# EasyEDA Pro project ProDoc_双路DRV8701驱动_2025-08-21.epro

# Schematic Schematic1
Board Name: Board1; Create Date: 2025-03-01; Page Name: P1; Project Name: DRV8701单独驱动; Schematic Name: Schematic1; Update Date: 2025-03-07; Company: 嘉立创EDA; Page Size: A4; Version: V1.0
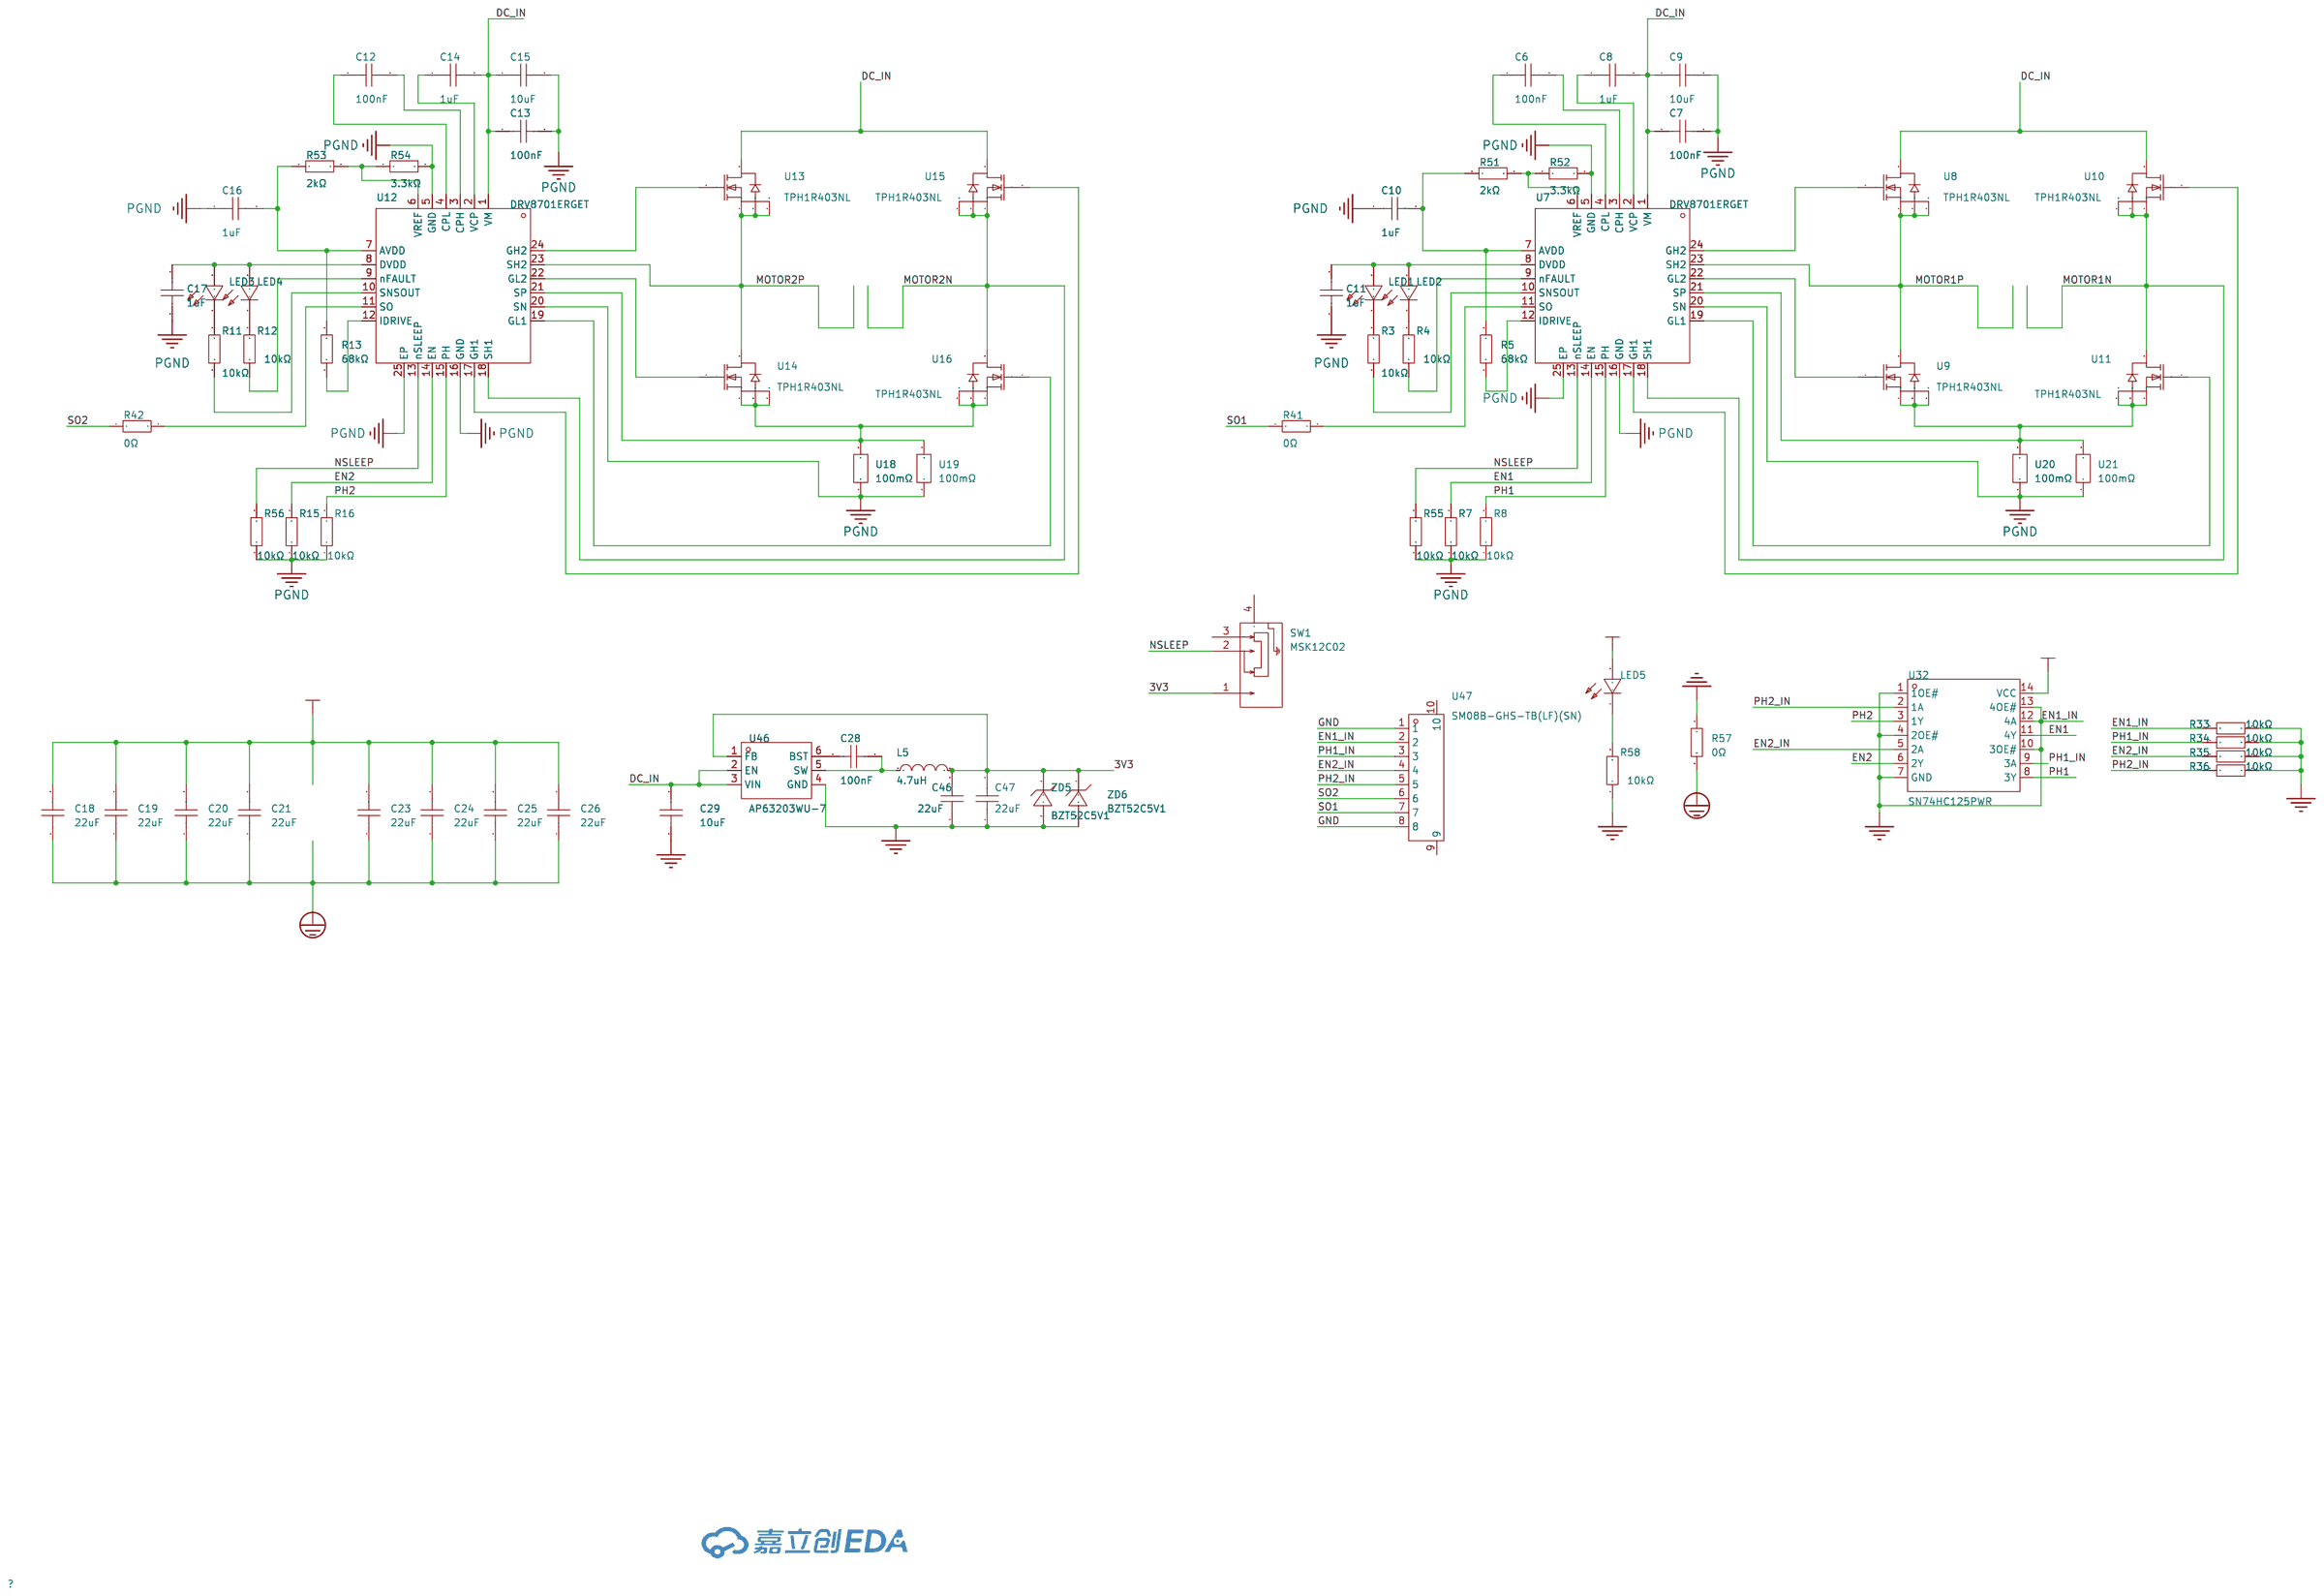
[diagram p0: schematic sheet]

## Parts
C6  100nF  [C0603]
C7  100nF  [C0603]
C8  1uF  [C0603]
C9  10uF  [C0603]
C10  1uF  [C0603]
C11  1uF  [C0603]
C12  100nF  [C0603]
C13  100nF  [C0603]
C14  1uF  [C0603]
C15  10uF  [C0603]
C16  1uF  [C0603]
C17  1uF  [C0603]
C18  22uF  [C1206]
C19  22uF  [C1206]
C20  22uF  [C1206]
C21  22uF  [C1206]
C23  22uF  [C1206]
C24  22uF  [C1206]
C25  22uF  [C1206]
C26  22uF  [C1206]
C28  100nF  [C0603]
C29  10uF  [C0603]
C46  22uF  [C0805]
C47  22uF  [C0805]
L5  4.7uH  [IND-SMD_L4.4-W4.2]
LED1  NCD0603R1  [LED0603-RD_RED]
LED2  NCD0603R1  [LED0603-RD_RED]
LED3  NCD0603R1  [LED0603-RD_RED]
LED4  NCD0603R1  [LED0603-RD_RED]
LED5  NCD0603R1  [LED0603-RD_RED]
R3  10kΩ  [R0603]
R4  10kΩ  [R0603]
R5  68kΩ  [R0603]
R7  10kΩ  [R0603]
R8  10kΩ  [R0603]
R11  10kΩ  [R0603]
R12  10kΩ  [R0603]
R13  68kΩ  [R0603]
R15  10kΩ  [R0603]
R16  10kΩ  [R0603]
R33  10kΩ  [R0603]
R34  10kΩ  [R0603]
R35  10kΩ  [R0603]
R36  10kΩ  [R0603]
R41  0Ω  [R0603]
R42  0Ω  [R0603]
R51  2kΩ  [R0603]
R52  3.3kΩ  [R0603]
R53  2kΩ  [R0603]
R54  3.3kΩ  [R0603]
R55  10kΩ  [R0603]
R56  10kΩ  [R0603]
R57  0Ω  [R0603]
R58  10kΩ  [R0603]
SW1  MSK12C02  [SW-TH_MSK12C02]
U7  DRV8701ERGET  [VQFN-24_L4.0-W4.0-P0.50-BL-EP2.5]
U8  TPH1R403NL  [TDSON-8_L5.9-W5.2-P1.27-BL]
U9  TPH1R403NL  [TDSON-8_L5.9-W5.2-P1.27-BL]
U10  TPH1R403NL  [TDSON-8_L5.9-W5.2-P1.27-BL]
U11  TPH1R403NL  [TDSON-8_L5.9-W5.2-P1.27-BL]
U12  DRV8701ERGET  [VQFN-24_L4.0-W4.0-P0.50-BL-EP2.5]
U13  TPH1R403NL  [TDSON-8_L5.9-W5.2-P1.27-BL]
U14  TPH1R403NL  [TDSON-8_L5.9-W5.2-P1.27-BL]
U15  TPH1R403NL  [TDSON-8_L5.9-W5.2-P1.27-BL]
U16  TPH1R403NL  [TDSON-8_L5.9-W5.2-P1.27-BL]
U18  100mΩ  [R1206]
U19  100mΩ  [R1206]
U20  100mΩ  [R1206]
U21  100mΩ  [R1206]
U32  SN74HC125PWR  [TSSOP-14_L5.0-W4.4-P0.65-LS6.5-BL]
U46  AP63203WU-7  [TSOT-26_L2.9-W1.6-P0.95-LS2.8-BL]
U47  SM08B-GHS-TB(LF)(SN)  [CONN-SMD_SM08B-GHS-TB-LF-SN]
ZD5  BZT52C5V1  [SOD-123_L2.8-W1.8-LS3.7-RD]
ZD6  BZT52C5V1  [SOD-123_L2.8-W1.8-LS3.7-RD]

## Library data of the parts
C6 C7 C12 C13 = CGA0603X7R104K500JT: 容值:100nF;精度:±10%;额定电压:50V;材质(温度系数):X7R;; LCSC Part Name: 100nF ±10% 50V; Supplier Part: C6119867; Manufacturer: HRE(芯声); Supplier Footprint: 0603; JLCPCB Part Class: 扩展库; Supplier: LCSC; Tolerance: ±10%; Voltage Rated: 50V; Temperature Coefficient: X7R
C8 C10 C11 C14 C16 C17 = CL10A105KB8NNNC: 容值:1uF;精度:±10%;额定电压:50V;材质(温度系数):X5R;; LCSC Part Name: 1uF ±10% 50V; Supplier Part: C15849; Manufacturer: SAMSUNG(三星); Supplier Footprint: 0603; JLCPCB Part Class: 基础库; Datasheet: https://atta.szlcsc.com/upload/public/pdf/source/20160218/1457707763339.pdf; Supplier: LCSC; Tolerance: ±10%; Voltage Rated: 50V; Temperature Coefficient: X5R
C9 C15 = GRM188R6YA106MA73D: 容值:10uF;精度:±20%;额定电压:35V;材质(温度系数):X5R;; LCSC Part Name: 10uF ±20% 35V; Supplier Part: C194427; Manufacturer: muRata(村田); Supplier Footprint: 0603; JLCPCB Part Class: 扩展库; Datasheet: https://atta.szlcsc.com/upload/public/pdf/source/20210128/C194427_FCA3640823207DDB58700A82F1A19B5F.pdf; Supplier: LCSC; Tolerance: ±20%; Voltage Rated: 35V; Temperature Coefficient: X5R
C18-C21 C23-C26 = CGA1206X5R226M350NT: 容值:22uF;精度:±20%;额定电压:35V;材质(温度系数):X5R;; LCSC Part Name: 22uF ±20% 35V; Supplier Part: C6119969; Manufacturer: HRE(芯声); Supplier Footprint: 1206; JLCPCB Part Class: 扩展库; Supplier: LCSC; Tolerance: ±20%; Voltage Rated: 35V; Temperature Coefficient: X5R
C28 C29 = CAP_0603: Supplier Footprint: 0603
C46 C47 = CAP_0805: Supplier Footprint: 0805
L5 = MWSA0402S-4R7MT: 电感值:4.7uH;精度:±20%;额定电流:2.8A;饱和电流(Isat):3A;类型:-;; LCSC Part Name: 4.7uH ±20% 3A; Supplier Part: C408337; Manufacturer: Sunlord(顺络); Supplier Footprint: SMD,4.4x4.2mm; JLCPCB Part Class: 扩展库; Datasheet: https://atta.szlcsc.com/upload/public/pdf/source/20231024/D9DB0CBBB5804BFBC9233D4A02F4216A.pdf; Supplier: LCSC; Tolerance: ±20%; Rated Current: 2.8A; Saturation Current (Isat): 3A; DC Resistance (DCR): 105mΩ
LED1-LED5 = NCD0603R1_C84263: 灯头类型:-;发光颜色:红色;正向电压(VF):1.6V~2.6V;功率:65mW;正向电流:20mA;主波长:615nm~630nm;二极管配置:独立二极管;透镜颜色:无色透明透镜;色温:-;发光强度:80mcd~220mcd;发光角度:130°;载带方式:-;工作温度:-30℃~+85℃;; Supplier Part: C84263; Manufacturer: 国星光电; Supplier Footprint: 0603; JLCPCB Part Class: 扩展库; Datasheet: https://atta.szlcsc.com/upload/public/pdf/source/20200820/C84263_DABC6A75E58F576973B407FDBA283D60.pdf; Supplier: LCSC; Emitted Color: 红色; Forward Voltage (VF): 1.6V~2.6V; Power Dissipation: 65mW; Forward Current: 20mA; Dominant Wavelength: 615nm~630nm; Diode Configuration: 独立二极管; Lens Color: 无色透明透镜; Luminous Intensity: 80mcd~220mcd; Viewing Angle: 130°; Operating Temperature: -30℃~+85℃
R3 R4 R7 R8 R11 R12 R15 R16 R33-R36 R55 R56 R58 = 0603WAF1002T5E: 电阻类型:厚膜电阻;阻值:10kΩ;精度:±1%;功率:100mW;最大工作电压:75V;温度系数:±100ppm/℃;; LCSC Part Name: 厚膜电阻 10kΩ ±1% 100mW; Supplier Part: C25804; Manufacturer: UNI-ROYAL(厚声); Supplier Footprint: 0603; JLCPCB Part Class: 基础库; Datasheet: https://atta.szlcsc.com/upload/public/pdf/source/20200306/C422600_1E6D84923E4A46A82E41ADD87F860B5C.pdf; Supplier: LCSC; Type: 厚膜电阻; Tolerance: ±1%; Power(Watts): 100mW; Overload Voltage (Max): 75V; Temperature Coefficient: ±100ppm/℃; Operating Temperature Range: -55℃~+155℃
R5 R13 = 0603WAF6802T5E: 电阻类型:厚膜电阻;阻值:68kΩ;精度:±1%;功率:100mW;最大工作电压:75V;温度系数:±100ppm/℃;; LCSC Part Name: 68kΩ ±1% 100mW 厚膜电阻; Supplier Part: C23231; Manufacturer: UNI-ROYAL(厚声); Supplier Footprint: 0603; JLCPCB Part Class: 基础库; Datasheet: https://atta.szlcsc.com/upload/public/pdf/source/20200306/C422600_1E6D84923E4A46A82E41ADD87F860B5C.pdf; Supplier: LCSC; Type: 厚膜电阻; Tolerance: ±1%; Power(Watts): 100mW; Overload Voltage (Max): 75V; Temperature Coefficient: ±100ppm/℃; Operating Temperature Range: -55℃~+155℃
R41 R42 R57 = 0603WAF0000T5E: 电阻类型:厚膜电阻;阻值:0Ω;精度:±1%;功率:100mW;最大工作电压:75V;; LCSC Part Name: 0Ω ±1% 100mW 厚膜电阻; Supplier Part: C21189; Manufacturer: UNI-ROYAL(厚声); Supplier Footprint: 0603; JLCPCB Part Class: 基础库; Datasheet: https://atta.szlcsc.com/upload/public/pdf/source/20200306/C422600_1E6D84923E4A46A82E41ADD87F860B5C.pdf; Supplier: LCSC; Type: 厚膜电阻; Tolerance: ±1%; Power(Watts): 100mW; Overload Voltage (Max): 75V; Operating Temperature Range: -55℃~+155℃
R51 R53 = 0603WAF2001T5E: 电阻类型:厚膜电阻;阻值:2kΩ;精度:±1%;功率:100mW;最大工作电压:75V;温度系数:±100ppm/℃;; LCSC Part Name: 2kΩ ±1% 100mW 厚膜电阻; Supplier Part: C22975; Manufacturer: UNI-ROYAL(厚声); Supplier Footprint: 0603; JLCPCB Part Class: 基础库; Datasheet: https://atta.szlcsc.com/upload/public/pdf/source/20200306/C422600_1E6D84923E4A46A82E41ADD87F860B5C.pdf; Supplier: LCSC; Type: 厚膜电阻; Tolerance: ±1%; Power(Watts): 100mW; Overload Voltage (Max): 75V; Temperature Coefficient: ±100ppm/℃; Operating Temperature Range: -55℃~+155℃
R52 R54 = 0603WAF3301T5E: 电阻类型:厚膜电阻;阻值:3.3kΩ;精度:±1%;功率:100mW;最大工作电压:75V;温度系数:±100ppm/℃;; LCSC Part Name: 3.3kΩ ±1% 100mW 厚膜电阻; Supplier Part: C22978; Manufacturer: UNI-ROYAL(厚声); Supplier Footprint: 0603; JLCPCB Part Class: 基础库; Datasheet: https://atta.szlcsc.com/upload/public/pdf/source/20200306/C422600_1E6D84923E4A46A82E41ADD87F860B5C.pdf; Supplier: LCSC; Type: 厚膜电阻; Tolerance: ±1%; Power(Watts): 100mW; Overload Voltage (Max): 75V; Temperature Coefficient: ±100ppm/℃; Operating Temperature Range: -55℃~+155℃
SW1 = MSK12C02: 电路结构:单刀双掷;安装方式:卧贴;开关颜色:-;额定电流(DC):50mA;额定电压(DC):12V;额定电流(AC):-;额定电压(AC):-;机械寿命:1万次;; LCSC Part Name: 两档侧拨贴片 7脚 滑动开关; Supplier Part: C431540; Manufacturer: SHOU HAN(首韩); Supplier Footprint: SMD; JLCPCB Part Class: 扩展库; Datasheet: https://atta.szlcsc.com/upload/public/pdf/source/20190925/C431540_89155AEF0758B9AD1B2D805F83FB12E3.pdf; Supplier: LCSC; Circuit: 单刀双掷; Pin Style: SMD接片; Switch Length: 8mm; Switch Width: 2.8mm; Switch Height: 1.4mm; Mounting Style: 卧贴; Current Rating (DC): 50mA; Voltage Rating (DC): 12V; Mechanical Life: 1万次; Operating Temperature: -20℃~+70℃
U7 U12 = DRV8701ERGET: DRV8701 47V H 桥智能栅极驱动器; LCSC Part Name: 有刷直流电机驱动芯片 5.5V; Supplier Part: C132049; Manufacturer: TI(德州仪器); Supplier Footprint: VQFN-24(4x4); JLCPCB Part Class: 扩展库; Datasheet: https://www.ti.com/cn/lit/gpn/drv8701; Supplier: LCSC
U8-U11 U13-U16 = TPH1R403NL_C19268167: Supplier Part: C19268167; Manufacturer: TECH PUBLIC(台舟); JLCPCB Part Class: 扩展库; Datasheet: https://atta.szlcsc.com/upload/public/pdf/source/20231201/E668D9B30DA1C5FDF2CA4EE637776407.pdf; Supplier: LCSC
U18-U21 = FRM121WFR100TM: 电阻类型:采样电阻;阻值:100mΩ;精度:±1%;额定压降:-;功率:1W;温度系数:±50ppm/℃;安装方式:-;; LCSC Part Name: 100mΩ ±1% 1W; Supplier Part: C7467250; Manufacturer: FOJAN(富捷); Supplier Footprint: 1206; JLCPCB Part Class: 扩展库; Supplier: LCSC; Type: 采样电阻; Tolerance: ±1%; Power(Watts): 1W; Temperature Coefficient: ±50ppm/℃
U32 = SN74HC125PWR: 输入类型:-;电源电压:2V~6V;元件数:4;每个元件位数:1;灌电流(IOL):7.8mA;拉电流(IOH):7.8mA;; Supplier Part: C132994; Manufacturer: TI(德州仪器); Supplier Footprint: TSSOP-14; JLCPCB Part Class: 扩展库; Datasheet: https://www.ti.com/cn/lit/gpn/sn74hc125; Supplier: LCSC; output type: 三态; Supply Voltage: 2V~6V; Number of Elements: 4; Number of Bits per Element: 1; Sink Current: 7.8mA; Source Current: 7.8mA; Logic Family: 74HC; Operating Temperature: -40℃~+85℃
U46 = AP63203WU-7: 功能类型:降压型;输出类型:固定;输入电压:3.8V~32V;输出电压:3.3V;输出电流(最大值):2A;; Supplier Part: C780769; Manufacturer: DIODES(美台); Supplier Footprint: TSOT-23-6; JLCPCB Part Class: 扩展库; Datasheet: https://atta.szlcsc.com/upload/public/pdf/source/20210622/C780769_099C67289BD3EC61AAFB52D8B07125B3.pdf; Supplier: LCSC; Function: 降压型; Output Type: 固定; Input Voltage: 3.8V~32V; Output Voltage: 3.3V; Output Current (Max): 2A; Switching Frequency: 1.1MHz; Operating Temperature: -40℃~+85℃@(TA); Synchronous Rectification: 是; Number of Outputs: 1; Topology: 降压式; Switch tube (built-in/external): 内置
U47 = SM08B-GHS-TB(LF)(SN): 插针结构:1x8P;间距:1.25mm;安装方式:卧贴;参考系列:GH;总PIN数:8P;排数:1;每排PIN数:8;行距:-;额定电流:1A;触头材质:磷青铜;触头镀层:锡;工作温度范围:-25℃~+85℃;; LCSC Part Name: 1x8P 间距:1.25mm 卧贴 系列:GH; Supplier Part: C265111; Manufacturer: JST; Supplier Footprint: SMD,P=1.25mm,卧贴; JLCPCB Part Class: 扩展库; Datasheet: https://atta.szlcsc.com/upload/public/pdf/source/20221128/D5F81EE9B4EA03745FB033843433A0AF.pdf; Supplier: LCSC; Pins Structure: 1x8P; Pitch: 1.25mm; Mounting Style: 卧贴; Reference Series: GH; Number of Pins: 8P; Number of Rows: 1; Number of PINs Per Row: 8; Current Rating (Max): 1A; Contact Material: 磷青铜; Contact Plating: 锡; Operating Temperature Range: -25℃~+85℃; Rated Voltage (Max): 50V; Plastic Material: PA9T; Flame Retardant Rating: UL94V-0; Supplementary Features: 辅助焊脚; Colour: 白色; Z-Height of the Board: 4.25mm; X-Length of Bottom Edge on Board (Spacing Line): 13.25mm; Y-Width of Bottom Edge on Board: 4.13mm
ZD5 ZD6 = BZT52C5V1_C2117: 二极管配置:独立式;稳压值(标称值):5.1V;稳压值(范围):4.8V~5.4V;功率:350mW;精度:-;; LCSC Part Name: BZT52C5V1 W8; Supplier Part: C2117; Manufacturer: CJ(江苏长电/长晶); Supplier Footprint: SOD-123; JLCPCB Part Class: 扩展库; Datasheet: https://atta.szlcsc.com/upload/public/pdf/source/20140508/1457707057629.pdf; Supplier: LCSC; Diode Configuration: 独立式; Zener Voltage (Nom): 5.1V; Reverse Leakage Current (Ir): 2uA@2V; Zener Voltage (Range): 4.8V~5.4V; Power Dissipation: 350mW; Zener Impedance (Zzt): 60Ω

## Nets
3V3: C46.2 C47.2 L5.2 LED5.2(A) SW1.1 U32.14(VCC) U46.1(FB) ZD5.1(K) ZD6.1(K)
GND: C29.1 C46.1 C47.1 R33.2 R34.2 R35.2 R36.2 R57.1 R58.1 U32.1(1OE#) U32.4(2OE#) U32.7(GND) U32.10(3OE#) U32.13(4OE#) U46.4(GND) U47.1 U47.8 ZD5.2(A) ZD6.2(A)
PGND: C7.2 C9.2 C10.1 C11.1 C13.2 C15.2 C16.1 C17.1 C18.1 C19.1 C20.1 C21.1 C23.1 C24.1 C25.1 C26.1 R7.1 R8.1 R15.1 R16.1 R52.2 R54.2 R55.1 R56.1 R57.2 U7.5(GND) U7.16(GND) U7.20(SN) U7.25(EP) U12.5(GND) U12.16(GND) U12.20(SN) U12.25(EP) U18.1 U19.1 U20.1 U21.1
DC_IN: C7.1 C8.2 C9.1 C13.1 C14.2 C15.1 C18.2 C19.2 C20.2 C21.2 C23.2 C24.2 C25.2 C26.2 C29.2 U7.1(VM) U8.5(D) U10.5(D) U12.1(VM) U13.5(D) U15.5(D) U46.2(EN) U46.3(VIN)
EN1: R7.2 U7.14(EN) U32.11(4Y)
EN1_IN: R33.1 U32.12(4A) U47.2
EN2: R15.2 U12.14(EN) U32.6(2Y)
EN2_IN: R35.1 U32.5(2A) U47.4
MOTOR1N: U7.18(SH1) U10.1(S) U10.2(S) U10.3(S) U11.5(D)
MOTOR1P: U7.23(SH2) U8.1(S) U8.2(S) U8.3(S) U9.5(D)
MOTOR2N: U12.18(SH1) U15.1(S) U15.2(S) U15.3(S) U16.5(D)
MOTOR2P: U12.23(SH2) U13.1(S) U13.2(S) U13.3(S) U14.5(D)
NSLEEP: R55.2 R56.2 SW1.2 U7.13(nSLEEP) U12.13(nSLEEP)
PH1: R8.2 U7.15(PH) U32.8(3Y)
PH1_IN: R34.1 U32.9(3A) U47.3
PH2: R16.2 U12.15(PH) U32.3(1Y)
PH2_IN: R36.1 U32.2(1A) U47.5
SO1: R41.1 U47.7
SO2: R42.1 U47.6
$1N2211: C11.2 LED1.2(A) LED2.2(A) U7.8(DVDD)
$1N2213: R41.2 U7.11(SO)
$1N2223: C10.2 R5.2 R51.1 U7.7(AVDD)
$1N2224: R5.1 U7.12(IDRIVE)
$1N2225: R4.1 U7.9(nFAULT)
$1N2226: R3.1 U7.10(SNSOUT)
$1N2227: LED2.1(K) R4.2
$1N2228: LED1.1(K) R3.2
$1N2229: R51.2 R52.1 U7.6(VREF)
$1N2235: C8.1 U7.2(VCP)
$1N2236: C6.1 U7.4(CPL)
$1N2237: C6.2 U7.3(CPH)
$1N2244: U7.17(GH1) U10.4(G)
$1N2245: U7.19(GL1) U11.4(G)
$1N2246: U7.21(SP) U9.1(S) U9.2(S) U9.3(S) U11.1(S) U11.2(S) U11.3(S) U20.2 U21.2
$1N2248: U7.22(GL2) U9.4(G)
$1N2249: U7.24(GH2) U8.4(G)
$1N2250: U12.24(GH2) U13.4(G)
$1N2251: U12.22(GL2) U14.4(G)
$1N2253: U12.21(SP) U14.1(S) U14.2(S) U14.3(S) U16.1(S) U16.2(S) U16.3(S) U18.2 U19.2
$1N2254: U12.19(GL1) U16.4(G)
$1N2255: U12.17(GH1) U15.4(G)
$1N2262: C12.2 U12.3(CPH)
$1N2263: C12.1 U12.4(CPL)
$1N2264: C14.1 U12.2(VCP)
$1N2270: R53.2 R54.1 U12.6(VREF)
$1N2271: C17.2 LED3.2(A) LED4.2(A) U12.8(DVDD)
$1N2272: LED3.1(K) R11.2
$1N2273: LED4.1(K) R12.2
$1N2274: R11.1 U12.10(SNSOUT)
$1N2275: R12.1 U12.9(nFAULT)
$1N2277: R42.2 U12.11(SO)
$1N2278: R13.1 U12.12(IDRIVE)
$1N2279: C16.2 R13.2 R53.1 U12.7(AVDD)
$1N16004: C28.2 L5.1 U46.5(SW)
$1N16007: C28.1 U46.6(BST)
$1N18591: LED5.1(K) R58.2

Not connected (* = marked no-connect by the designer): SW1 3 4; U47 9 10

# Board PCB1
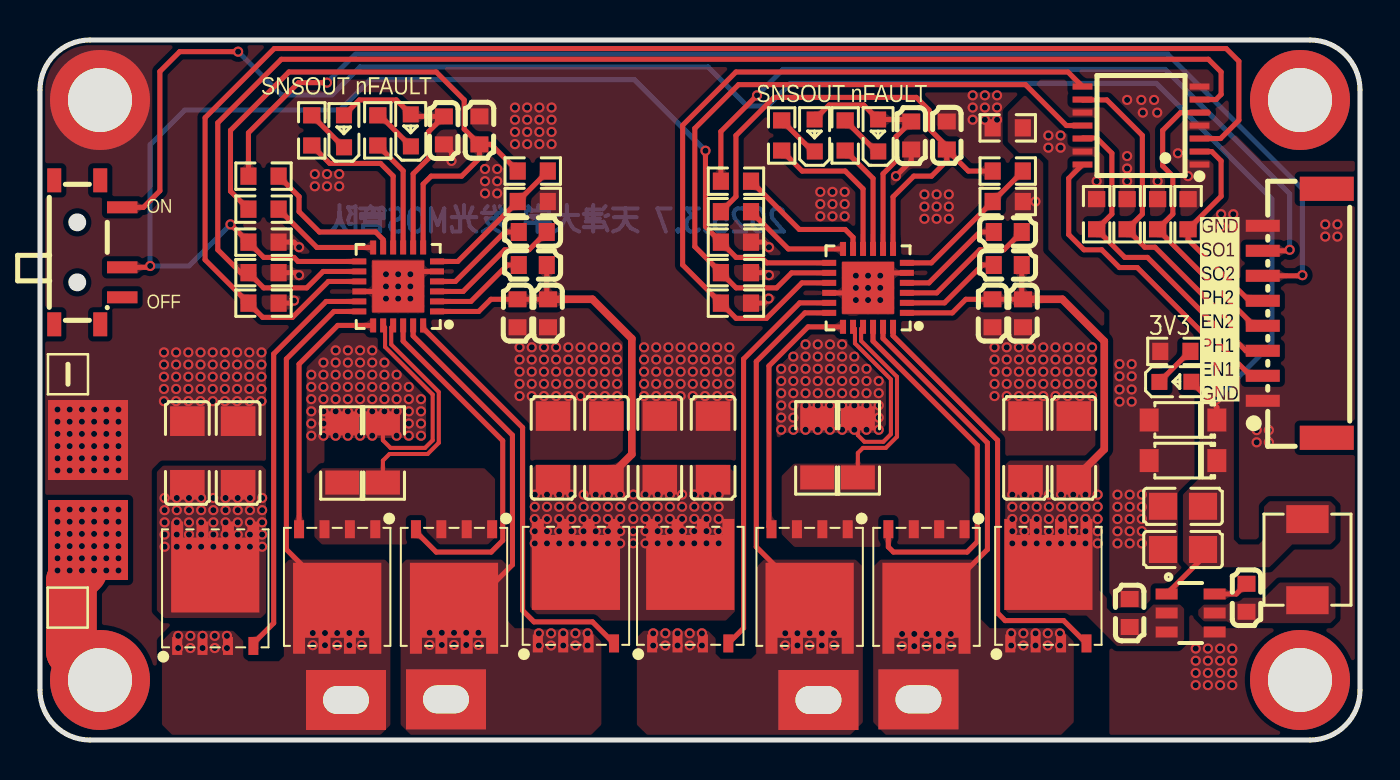
[diagram p1: board, top side]
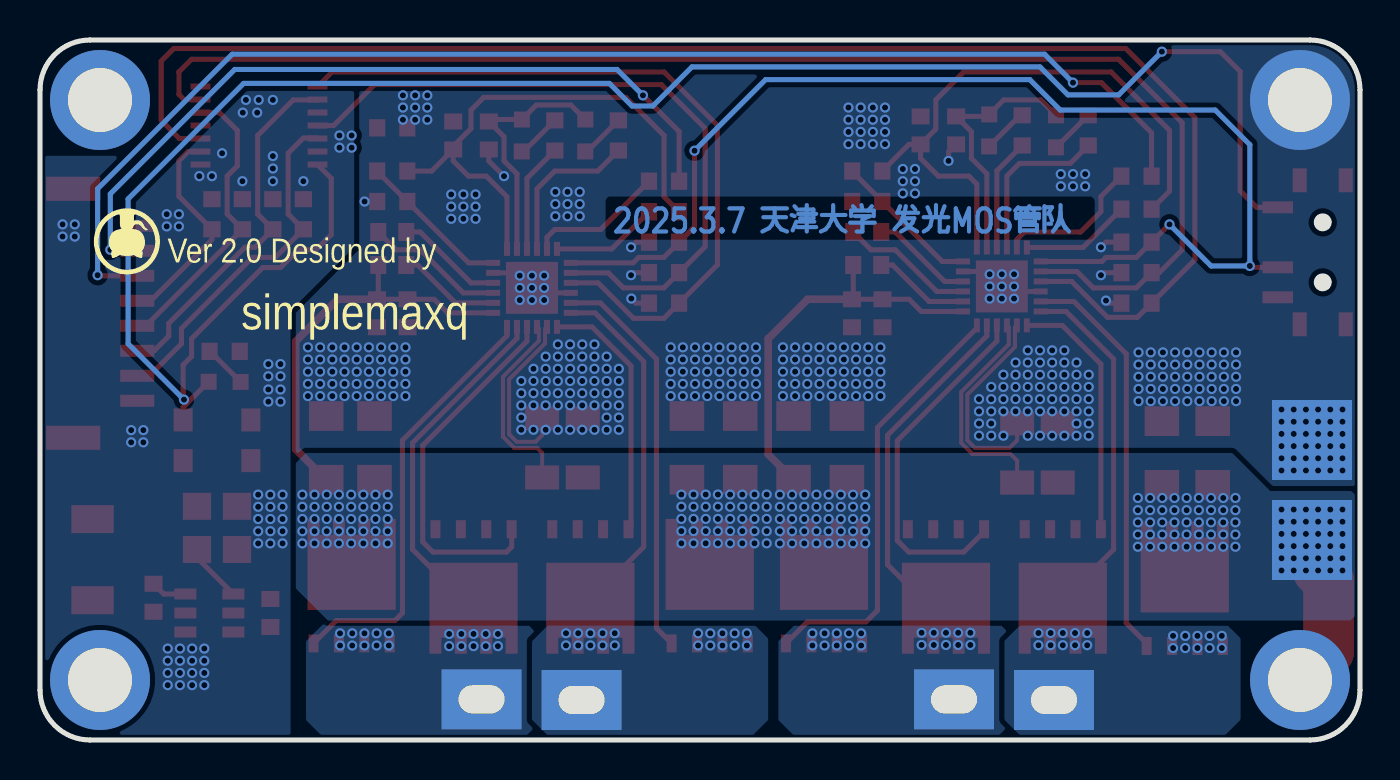
[diagram p2: board, bottom side, seen from below]

Outline 66 x 35 mm; copper layers: Top Layer, Bottom Layer. Coordinates in mm from the lower left corner of the outline.
Outline path: 0,32.5 0,2.5 arc(0.73,0.73) 2.5,0 63.5,0 arc(65.27,0.73) 66,2.5 66,32.5 arc(65.27,34.27) 63.5,35 2.5,35 arc(0.73,34.27) 0,32.5
Stack: Top Layer 0.035mm / Dielectric1 1.51mm FR4 er 4.5 / Bottom Layer 0.035mm

## Design rules (mm)
template: 自定义配置
spacing copperThickness1oz (default): track to track 0.102, other pairs 0.152 to 0.3
spacing copperThickness2oz: track to track 0.203, other pairs 0.152 to 0.3
track width copperThickness1oz (default): min 0.127, default 0.254, max 2.54
track width copperThickness2oz: min 0.203, default 0.254, max 2.54
differential pair differentialPair (default): width min 0.127, default 0.254, max 2.54; gap min 0.152, default 0.152
via viaSize (default): diameter min 0.5, default 0.61, max 10; hole min 0.3, default 0.305, max 6.3

## Placement (name value [footprint] x y rotation side)
C6  100nF  [C0603]  48.39 25.4 0 top
C7  100nF  [C0603]  49.15 21.34 270 top
C8  1uF  [C0603]  48.39 23.75 0 top
C9  10uF  [C0603]  47.62 21.34 270 top
C10  1uF  [C0603]  45.34 30.23 270 top
C11  1uF  [C0603]  43.56 30.23 90 top
C12  100nF  [C0603]  24.64 25.4 0 top
C13  100nF  [C0603]  23.88 21.34 270 top
C14  1uF  [C0603]  24.64 23.75 0 top
C15  10uF  [C0603]  25.4 21.34 270 top
C16  1uF  [C0603]  21.97 30.48 270 top
C17  1uF  [C0603]  20.19 30.48 90 top
C18  22uF  [C1206]  9.91 14.35 270 top
C19  22uF  [C1206]  7.37 14.35 270 top
C20  22uF  [C1206]  25.65 14.61 270 top
C21  22uF  [C1206]  28.32 14.61 270 top
C23  22uF  [C1206]  51.69 14.61 270 top
C24  22uF  [C1206]  49.28 14.61 270 top
C25  22uF  [C1206]  33.66 14.61 270 top
C26  22uF  [C1206]  30.99 14.61 270 top
C28  100nF  [C0603]  60.32 7.11 270 top
C29  10uF  [C0603]  54.48 6.35 270 top
C46  22uF  [C0805]  57.15 9.53 0 top
C47  22uF  [C0805]  57.15 11.68 0 top
L5  4.7uH  [IND-SMD_L4.4-W4.2]  63.37 9.02 270 top
LED1  NCD0603R1  [LED0603-RD_RED]  38.74 30.23 90 top
LED2  NCD0603R1  [LED0603-RD_RED]  41.91 30.23 90 top
LED3  NCD0603R1  [LED0603-RD_RED]  15.2 30.43 90 top
LED4  NCD0603R1  [LED0603-RD_RED]  18.54 30.48 90 top
LED5  NCD0603R1  [LED0603-RD_RED]  56.77 17.91 0 top
NOREF  -  [Pad_e3047]  2.4 10 0 top
NOREF#2  -  [Pad_e85]  63 32 0 top
NOREF#3  -  [Pad_e88]  3 3 0 top
NOREF#4  -  [Pad_e72]  63 3 0 top
NOREF#5  -  [Pad_e3065]  15.3 2 0 top
NOREF#6  -  [Pad_e89]  3 32 0 top
NOREF#7  -  [Pad_e3069]  43.92 2.03 0 top
NOREF#8  -  [Pad_e239]  2.4 15 0 top
NOREF#9  -  [Pad_e3067]  20.3 2.03 0 top
NOREF#10  -  [Pad_e3046]  2.4 15 0 top
NOREF#11  -  [Pad_e3068]  38.92 2 0 top
NOREF#12  -  [Pad_e237]  2.4 10 0 top
R3  10kΩ  [R0603]  37.08 30.23 90 top
R4  10kΩ  [R0603]  40.26 30.23 90 top
R5  68kΩ  [R0603]  34.8 26.42 180 top
R7  10kΩ  [R0603]  34.8 23.37 180 top
R8  10kΩ  [R0603]  34.8 21.84 180 top
R11  10kΩ  [R0603]  13.59 30.48 90 top
R12  10kΩ  [R0603]  16.89 30.48 90 top
R13  68kΩ  [R0603]  11.18 26.54 180 top
R15  10kΩ  [R0603]  11.18 23.37 180 top
R16  10kΩ  [R0603]  11.18 21.84 180 top
R33  10kΩ  [R0603]  52.83 26.29 90 top
R34  10kΩ  [R0603]  54.36 26.29 90 top
R35  10kΩ  [R0603]  55.88 26.29 90 top
R36  10kΩ  [R0603]  57.4 26.29 90 top
R41  0Ω  [R0603]  34.8 27.94 0 top
R42  0Ω  [R0603]  11.18 28.19 0 top
R51  2kΩ  [R0603]  48.39 28.45 0 top
R52  3.3kΩ  [R0603]  48.39 26.92 0 top
R53  2kΩ  [R0603]  24.64 28.45 0 top
R54  3.3kΩ  [R0603]  24.64 26.92 0 top
R55  10kΩ  [R0603]  34.8 24.89 180 top
R56  10kΩ  [R0603]  11.18 24.89 180 top
R57  0Ω  [R0603]  48.39 30.61 180 top
R58  10kΩ  [R0603]  56.77 19.43 0 top
SW1  MSK12C02  [SW-TH_MSK12C02]  2.41 24.38 270 top
U7  DRV8701ERGET  [VQFN-24_L4.0-W4.0-P0.50-BL-EP2.5]  41.4 22.61 90 top
U8  TPH1R403NL  [TDSON-8_L5.9-W5.2-P1.27-BL]  50.42 6.6 0 top
U9  TPH1R403NL  [TDSON-8_L5.9-W5.2-P1.27-BL]  44.32 8.76 180 top
U10  TPH1R403NL  [TDSON-8_L5.9-W5.2-P1.27-BL]  32.51 6.6 0 top
U11  TPH1R403NL  [TDSON-8_L5.9-W5.2-P1.27-BL]  38.48 8.76 180 top
U12  DRV8701ERGET  [VQFN-24_L4.0-W4.0-P0.50-BL-EP2.5]  17.91 22.68 90 top
U13  TPH1R403NL  [TDSON-8_L5.9-W5.2-P1.27-BL]  26.8 6.6 0 top
U14  TPH1R403NL  [TDSON-8_L5.9-W5.2-P1.27-BL]  20.7 8.76 180 top
U15  TPH1R403NL  [TDSON-8_L5.9-W5.2-P1.27-BL]  8.76 6.48 0 top
U16  TPH1R403NL  [TDSON-8_L5.9-W5.2-P1.27-BL]  14.86 8.76 180 top
U18  100mΩ  [R1206]  17.15 14.35 270 top
U19  100mΩ  [R1206]  15.11 14.35 270 top
U20  100mΩ  [R1206]  38.86 14.61 270 top
U21  100mΩ  [R1206]  40.89 14.61 270 top
U32  SN74HC125PWR  [TSSOP-14_L5.0-W4.4-P0.65-LS6.5-BL]  55.05 30.72 90 top
U46  AP63203WU-7  [TSOT-26_L2.9-W1.6-P0.95-LS2.8-BL]  57.53 6.35 270 top
U47  SM08B-GHS-TB(LF)(SN)  [CONN-SMD_SM08B-GHS-TB-LF-SN]  62.74 21.34 90 top
ZD5  BZT52C5V1  [SOD-123_L2.8-W1.8-LS3.7-RD]  57.15 16 180 top
ZD6  BZT52C5V1  [SOD-123_L2.8-W1.8-LS3.7-RD]  57.15 13.97 180 top

## Footprints (pads in the part's own frame, mm; a bottom-side part is the same pattern mirrored in y, then rotated)
C0603
  rect 0.8x0.9 smd: 1(-0.7,0) 2(0.7,0)
C0805
  rect 1.41x1.35 smd: 1(-1,0) 2(1,0)
C1206
  rect 1.485x1.728 smd: 1(-1.593,0) 2(1.593,0)
CONN-SMD_SM08B-GHS-TB-LF-SN
  rect 0.6x1.7 smd: 1(-4.375,1.6) 2(-3.125,1.6) 3(-1.875,1.6) 4(-0.625,1.6) 5(0.625,1.6) 6(1.875,1.6) 7(3.125,1.6) 8(4.375,1.6)
  rect 1.21x2.7 smd: 9(-6.225,-1.6) 10(6.225,-1.6)
IND-SMD_L4.4-W4.2
  rect 1.4x2.12 smd: 1(2.028,0) 2(-2.028,0)
LED0603-RD_RED
  rect 0.8x0.8 smd: 1(-0.799,-0.004) 2(0.799,0.004)
Pad_e72
  round 5 hole 3.2: 1(0,0)
Pad_e85
  round 5 hole 3.2: 1(0,0)
Pad_e88
  round 5 hole 3.2: 1(0,0)
Pad_e89
  round 5 hole 3.2: 1(0,0)
Pad_e237
  rect 4x4 smd: 1(0,0)
Pad_e239
  rect 4x4 smd: 1(0,0)
Pad_e3046
  rect 4x4 smd far side: 1(0,0)
Pad_e3047
  rect 4x4 smd far side: 1(0,0)
Pad_e3065
  rect 4x3 hole 2.3x1.4: 1(0,0)
Pad_e3067
  rect 4x3 hole 2.3x1.4: 1(0,0)
Pad_e3068
  rect 4x3 hole 2.3x1.4: 1(0,0)
Pad_e3069
  rect 4x3 hole 2.3x1.4: 1(0,0)
R0603
  rect 0.806x0.864 smd: 1(-0.753,0) 2(0.753,0)
R1206
  rect 1.208x1.701 smd: 1(-1.479,0) 2(1.479,0)
SOD-123_L2.8-W1.8-LS3.7-RD
  rect 0.95x1.15 smd: 1(-1.692,0) 2(1.692,0)
SW-TH_MSK12C02
  rect 0.6x1.524 smd: 1(-2.25,1.7) 2(0.75,1.7) 3(2.25,1.7)
  rect 1.2x0.7 smd: 4(-3.6,0.6) 4(-3.6,-1.7) 4(3.6,0.6) 4(3.6,-1.7)
TDSON-8_L5.9-W5.2-P1.27-BL
  rect 0.5x0.9 smd: 1(-1.905,-1.775) 2(-0.635,-1.775) 3(0.635,-1.775) 4(1.905,-1.775)
  custom 4.41x4.55 smd: 5(0,1.775)
TSOT-26_L2.9-W1.6-P0.95-LS2.8-BL
  rect 0.55x1.1 smd: 1(-0.95,-1.2) 2(0,-1.2) 3(0.95,-1.2) 4(0.95,1.2) 5(0,1.2) 6(-0.95,1.2)
TSSOP-14_L5.0-W4.4-P0.65-LS6.5-BL
  rect 0.305x0.991 smd: 1(-1.95,-2.925) 2(-1.3,-2.925) 3(-0.65,-2.925) 4(0,-2.925) 5(0.65,-2.925) 6(1.3,-2.925) 7(1.95,-2.925) 8(1.95,2.925) 9(1.3,2.925) 10(0.65,2.925) 11(0,2.925) 12(-0.65,2.925) 13(-1.3,2.925) 14(-1.95,2.925)
VQFN-24_L4.0-W4.0-P0.50-BL-EP2.5
  rect 0.3x0.7 smd: 1(-1.25,-1.942) 2(-0.75,-1.942) 3(-0.25,-1.942) 4(0.25,-1.942) 5(0.75,-1.942) 6(1.25,-1.942) 13(1.25,1.942) 14(0.75,1.942) 15(0.25,1.942) 16(-0.25,1.942) 17(-0.75,1.942) 18(-1.25,1.942)
  rect 0.7x0.3 smd: 7(1.948,-1.25) 8(1.948,-0.75) 9(1.948,-0.25) 10(1.948,0.25) 11(1.948,0.75) 12(1.948,1.25) 19(-1.948,1.25) 20(-1.948,0.75) 21(-1.948,0.25) 22(-1.948,-0.25) 23(-1.948,-0.75) 24(-1.948,-1.25)
  rect 2.6x2.6 smd: 25(0.001,-0.001)

## Nets
As in the schematic, except:
PGND: C7.2 C9.2 C10.1 C11.1 C13.2 C15.2 C16.1 C17.1 C18.1 C19.1 C20.1 C21.1 C23.1 C24.1 C25.1 C26.1 NOREF#6.1 NOREF#8.1 NOREF#10.1 R7.1 R8.1 R15.1 R16.1 R52.2 R54.2 R55.1 R56.1 R57.2 U7.5 U7.16 U7.20 U7.25 U12.5 U12.16 U12.20 U12.25 U18.1 U19.1 U20.1 U21.1
DC_IN: C7.1 C8.2 C9.1 C13.1 C14.2 C15.1 C18.2 C19.2 C20.2 C21.2 C23.2 C24.2 C25.2 C26.2 C29.2 NOREF.1 NOREF#3.1 NOREF#12.1 U7.1 U8.5 U10.5 U12.1 U13.5 U15.5 U46.2 U46.3
MOTOR1N: NOREF#11.1 U7.18 U10.1 U10.2 U10.3 U11.5
MOTOR1P: NOREF#7.1 U7.23 U8.1 U8.2 U8.3 U9.5
MOTOR2N: NOREF#5.1 U12.18 U15.1 U15.2 U15.3 U16.5
MOTOR2P: NOREF#9.1 U12.23 U13.1 U13.2 U13.3 U14.5

Pads without a net: NOREF#2 1; NOREF#4 1; SW1 3 4; U47 9 10

## Via types
v1: diameter 0.508, hole 0.305, Top Layer to Bottom Layer, 768 vias

## Routing (per net, layer and track width the routed paths; a pad name or vN(x,y) marks a point on that pad's centre or on a via; arc(x,y) is an arc through that point)
3V3: length 102.1
  Top Layer w0.254: C46.2 58.15,9.12 U46.1 ; U32.14 51.44,28.08 51.44,25.27 52.2,24.51 53.09,24.51 53.97,23.62 54.86,23.62 58.42,20.07 58.42,19.18 58.84,18.75 58.84,17.02 ; ZD5.1 58.84,16.64 LED5.2 ; SW1.1 5.17,26.63 5.99,27.46 5.99,33.43 6.98,34.42 v1(9.91,34.42)
  Bottom Layer w0.254: v1(58.8,17.02) 61.59,19.81 61.59,27.05 55.82,32.83 37.53,32.83 36.4,31.7 35.36,31.7 33.4,33.66 16,33.66 14.6,32.26 12.06,32.26 v1(9.91,34.42)
GND:
  vias: v1(50.42,30.23) v1(50.42,29.62) v1(51.03,30.23) v1(51.03,29.62) v1(52.83,27.94) v1(53.87,12.27) v1(53.87,11.66) v1(53.87,11.05) v1(53.87,10.44) v1(53.87,9.83) v1(53.97,18.8) v1(53.97,18.19) v1(53.97,17.53) v1(53.97,16.92) v1(54.36,32) v1(54.36,29.2) v1(54.36,28.58) v1(54.36,27.94) v1(54.48,12.27) v1(54.48,11.66) v1(54.48,11.05) v1(54.48,10.44) v1(54.48,9.83) v1(54.58,18.8) v1(54.58,18.19) v1(54.58,17.53) v1(54.58,16.92) v1(55.06,32) v1(55.14,31.37) v1(55.09,12.27) v1(55.09,11.66) v1(55.09,11.05) v1(55.09,10.44) v1(55.09,9.83) v1(55.7,32) v1(55.86,31.37) v1(55.88,27.94) v1(56.9,29.34) v1(57.4,28.19) v1(57.78,4.57) v1(57.78,3.96) v1(57.78,3.35) v1(57.78,2.74) v1(58.04,28.19) v1(58.39,4.57) v1(58.39,3.96) v1(58.39,3.35) v1(58.39,2.74) v1(59,4.57) v1(59,3.96) v1(59,3.35) v1(59,2.74) v1(59.06,26.29) v1(59.06,25.68) v1(59.61,4.57) v1(59.61,3.96) v1(59.61,3.35) v1(59.61,2.74) v1(59.66,26.29) v1(59.66,25.68) v1(60.83,15.49) v1(60.83,14.88) v1(61.44,15.49) v1(61.44,14.88) v1(64.26,25.78) v1(64.26,25.17) v1(64.87,25.78) v1(64.87,25.17)
PGND: length 36.3
  Top Layer w0.203: U12.20 17.25,20.63 17.25,19.65 19.63,17.27 19.63,14.99 19.25,14.61 17.53,14.61 17.15,14.99 U18.1 ; U21.1 40.89,15.24 41.22,14.91 42.16,14.91 42.54,15.29 42.54,18.03 40.75,19.83 40.75,20.56 U7.20
  Top Layer w0.254: R52.2 v1(49.77,26.92) ; R56.1 12.7,24.89 v1(12.95,24.64) ; R16.1 12.57,21.84 v1(12.7,21.97) ; C11.1 43.56,28.96 v1(42.8,28.19) ; U7.16 41.15,22.36 v1(41.4,22.61) ; C17.1 20.57,29.4 v1(20.57,28.96) ; v1(12.95,23.24) 12.83,23.37 R15.1 ; v1(42.01,23.22) 42.15,23.36 U7.5 ; R7.1 36.32,23.37 v1(36.45,23.24) ; v1(36.43,22.07) 36.21,21.84 R8.1 ; U12.16 17.66,22.43 v1(17.91,22.68) 18.66,23.43 U12.5 ; v1(36.45,24.64) 36.19,24.89 R55.1
  vias: v1(0.88,16.52) v1(0.88,15.91) v1(0.88,15.31) v1(0.88,14.69) v1(0.88,14.09) v1(0.88,13.48) v1(1.49,16.52) v1(1.49,15.91) v1(1.49,15.31) v1(1.49,14.69) v1(1.49,14.09) v1(1.49,13.48) v1(2.09,16.52) v1(2.09,15.91) v1(2.09,15.31) v1(2.09,14.69) v1(2.09,14.09) v1(2.09,13.48) v1(2.7,16.52) v1(2.7,15.91) v1(2.7,15.31) v1(2.7,14.69) v1(2.7,14.09) v1(2.7,13.48) v1(3.31,16.52) v1(3.31,15.91) v1(3.31,15.31) v1(3.31,14.69) v1(3.31,14.09) v1(3.31,13.48) v1(3.92,16.52) v1(3.92,15.91) v1(3.92,15.31) v1(3.92,14.69) v1(3.92,14.09) v1(3.92,13.48) v1(6.2,19.38) v1(6.2,18.77) v1(6.2,18.16) v1(6.2,17.55) v1(6.2,16.94) v1(6.81,19.38) v1(6.81,18.77) v1(6.81,18.16) v1(6.81,17.55) v1(6.81,16.94) v1(7.42,19.38) v1(7.42,18.77) v1(7.42,18.16) v1(7.42,17.55) v1(7.42,16.94) v1(8.03,19.38) v1(8.03,18.77) v1(8.03,18.16) v1(8.03,17.55) v1(8.03,16.94) v1(8.64,19.38) v1(8.64,18.77) v1(8.64,18.16) v1(8.64,17.55) v1(8.64,16.94) v1(9.25,19.38) v1(9.25,18.77) v1(9.25,18.16) v1(9.25,17.55) v1(9.25,16.94) v1(9.85,19.38) v1(9.85,18.77) v1(9.85,18.16) v1(9.85,17.55) v1(9.85,16.94) v1(10.47,19.38) v1(10.47,18.77) v1(10.47,18.16) v1(10.47,17.55) v1(10.47,16.94) v1(11.07,19.38) v1(11.07,18.77) v1(11.07,18.16) v1(11.07,17.55) v1(11.07,16.94) v1(13.56,18.26) v1(13.56,17.65) v1(13.56,17.04) v1(13.56,16.43) v1(13.56,15.82) v1(13.56,15.21) v1(13.74,28.3) v1(13.74,27.69) v1(14.17,18.87) v1(14.17,18.26) v1(14.17,17.65) v1(14.17,17.04) v1(14.17,16.43) v1(14.17,15.82) v1(14.17,15.21) v1(14.35,28.3) v1(14.35,27.69) v1(14.78,19.48) v1(14.78,18.87) v1(14.78,18.26) v1(14.78,17.65) v1(14.78,17.04) v1(14.78,16.43) v1(14.78,15.21) v1(14.96,28.3) v1(14.96,27.69) v1(15.39,19.48) v1(15.39,18.87) v1(15.39,18.26) v1(15.39,17.65) v1(15.39,17.04) v1(15.39,16.43) v1(15.39,15.21) v1(16,19.48) v1(16,18.87) v1(16,18.26) v1(16,17.65) v1(16,17.04) v1(16,16.43) v1(16,15.21) v1(16.61,19.48) v1(16.61,18.87) v1(16.61,18.26) v1(16.61,17.65) v1(16.61,17.04) v1(16.61,16.43) v1(16.61,15.21) v1(17.22,18.87) v1(17.22,18.26) v1(17.22,17.65) v1(17.22,17.04) v1(17.22,16.43) v1(17.3,23.29) v1(17.3,22.68) v1(17.3,22.07) v1(17.83,18.26) v1(17.83,17.65) v1(17.83,17.04) v1(17.83,16.43) v1(17.83,15.21) v1(17.91,23.29) v1(17.91,22.07) v1(18.44,17.65) v1(18.44,17.04) v1(18.44,16.43) v1(18.44,15.82) v1(18.44,15.21) v1(18.52,23.29) v1(18.52,22.68) v1(18.52,22.07) v1(19.05,17.04) v1(19.05,16.43) v1(19.05,15.82) v1(19.05,15.21) v1(22.25,28.55) v1(22.25,27.94) v1(22.25,27.33) v1(22.86,28.55) v1(22.86,27.94) v1(22.86,27.33) v1(23.75,31.62) v1(23.75,31.01) v1(23.75,30.4) v1(23.75,29.79) v1(23.98,19.63) v1(23.98,19.02) v1(23.98,18.42) v1(23.98,17.81) v1(23.98,17.2) v1(24.36,31.62) v1(24.36,31.01) v1(24.36,30.4) v1(24.36,29.79) v1(24.59,19.63) v1(24.59,19.02) v1(24.59,18.42) v1(24.59,17.81) v1(24.59,17.2) v1(24.97,31.62) v1(24.97,31.01) v1(24.97,30.4) v1(24.97,29.79) v1(25.2,19.63) v1(25.2,19.02) v1(25.2,18.42) v1(25.2,17.81) v1(25.2,17.2) v1(25.58,31.62) v1(25.58,31.01) v1(25.58,30.4) v1(25.58,29.79) v1(25.81,19.63) v1(25.81,19.02) v1(25.81,18.42) v1(25.81,17.81) v1(25.81,17.2) v1(26.42,19.63) v1(26.42,19.02) v1(26.42,18.42) v1(26.42,17.81) v1(26.42,17.2) v1(27.03,19.63) v1(27.03,19.02) v1(27.03,18.42) v1(27.03,17.81) v1(27.03,17.2) v1(27.63,19.63) v1(27.63,19.02) v1(27.63,18.42) v1(27.63,17.81) v1(27.63,17.2) v1(28.25,19.63) v1(28.25,19.02) v1(28.25,18.42) v1(28.25,17.81) v1(28.25,17.2) v1(28.85,19.63) v1(28.85,19.02) v1(28.85,18.42) v1(28.85,17.81) v1(28.85,17.2) v1(30.2,19.63) v1(30.2,19.02) v1(30.2,18.42) v1(30.2,17.81) v1(30.2,17.2) v1(30.81,19.63) v1(30.81,19.02) v1(30.81,18.42) v1(30.81,17.81) v1(30.81,17.2) v1(31.42,19.63) v1(31.42,19.02) v1(31.42,18.42) v1(31.42,17.81) v1(31.42,17.2) v1(32.03,19.63) v1(32.03,19.02) v1(32.03,18.42) v1(32.03,17.81) v1(32.03,17.2) v1(32.64,19.63) v1(32.64,19.02) v1(32.64,18.42) v1(32.64,17.81) v1(32.64,17.2) v1(33.25,19.63) v1(33.25,19.02) v1(33.25,18.42) v1(33.25,17.81) v1(33.25,17.2) v1(33.86,19.63) v1(33.86,19.02) v1(33.86,18.42) v1(33.86,17.81) v1(33.86,17.2) v1(34.47,19.63) v1(34.47,19.02) v1(34.47,18.42) v1(34.47,17.81) v1(34.47,17.2) v1(37.06,18.56) v1(37.06,17.95) v1(37.06,17.34) v1(37.06,16.73) v1(37.06,16.12) v1(37.06,15.51) v1(37.67,19.17) v1(37.67,18.56) v1(37.67,17.95) v1(37.67,17.34) v1(37.67,16.73) v1(37.67,16.12) v1(37.67,15.51) v1(38.28,19.78) v1(38.28,19.17) v1(38.28,18.56) v1(38.28,17.95) v1(38.28,17.34) v1(38.28,16.73) v1(38.28,15.51) v1(38.89,19.78) v1(38.89,19.17) v1(38.89,18.56) v1(38.89,17.95) v1(38.89,17.34) v1(38.89,16.73) v1(38.89,15.51) v1(39.01,27.41) v1(39.01,26.8) v1(39.01,26.19) v1(39.5,19.78) v1(39.5,19.17) v1(39.5,18.56) v1(39.5,17.95) v1(39.5,17.34) v1(39.5,16.73) v1(39.5,15.51) v1(39.62,27.41) v1(39.62,26.8) v1(39.62,26.19) v1(40.11,19.78) v1(40.11,19.17) v1(40.11,18.56) v1(40.11,17.95) v1(40.11,17.34) v1(40.11,16.73) v1(40.11,15.51) v1(40.23,27.41) v1(40.23,26.8) v1(40.23,26.19) v1(40.72,19.17) v1(40.72,18.56) v1(40.72,17.95) v1(40.72,17.34) v1(40.72,16.73) v1(40.72,15.51) v1(40.79,23.22) v1(40.79,22.61) v1(40.79,22) v1(41.33,18.56) v1(41.33,17.95) v1(41.33,17.34) v1(41.33,16.73) v1(41.33,15.51) v1(41.4,23.22) v1(41.4,22) v1(41.94,17.95) v1(41.94,17.34) v1(41.94,16.73) v1(41.94,16.12) v1(41.94,15.51) v1(42.01,22.61) v1(42.01,22) v1(44.22,27.28) v1(44.22,26.67) v1(44.22,26.06) v1(44.83,27.28) v1(44.83,26.67) v1(44.83,26.06) v1(45.44,27.28) v1(45.44,26.67) v1(45.44,26.06) v1(46.63,32.23) v1(46.63,31.62) v1(46.63,31.01) v1(47.24,32.23) v1(47.24,31.62) v1(47.24,31.01) v1(47.73,19.63) v1(47.73,19.02) v1(47.73,18.42) v1(47.73,17.81) v1(47.73,17.2) v1(47.85,32.23) v1(47.85,31.62) v1(47.85,31.01) v1(48.34,19.63) v1(48.34,19.02) v1(48.34,18.42) v1(48.34,17.81) v1(48.34,17.2) v1(48.95,19.63) v1(48.95,19.02) v1(48.95,18.42) v1(48.95,17.81) v1(48.95,17.2) v1(49.56,19.63) v1(49.56,19.02) v1(49.56,18.42) v1(49.56,17.81) v1(49.56,17.2) v1(50.16,19.63) v1(50.16,19.02) v1(50.16,18.42) v1(50.16,17.81) v1(50.16,17.2) v1(50.77,19.63) v1(50.77,19.02) v1(50.77,18.42) v1(50.77,17.81) v1(50.77,17.2) v1(51.38,19.63) v1(51.38,19.02) v1(51.38,18.42) v1(51.38,17.81) v1(51.38,17.2) v1(51.99,19.63) v1(51.99,19.02) v1(51.99,18.42) v1(51.99,17.81) v1(51.99,17.2) v1(52.6,19.63) v1(52.6,19.02) v1(52.6,18.42) v1(52.6,17.81) v1(52.6,17.2)
DC_IN: length 47.9
  Top Layer w0.254: v1(2.09,10.31) v1(2.09,9.69) v1(2.09,9.09) ; C8.2 49.09,22.1 C7.1 C9.1 46.29,22.04 45.61,21.36 U7.1 ; C14.2 25.34,22.1 C15.1 C13.1 22.54,22.04 21.94,21.43 U12.1
  Top Layer w0.381: C23.2 53.21,14.54 53.21,19.94 51.12,22.04 C7.1 ; C15.1 27.62,22.04 29.59,20.07 29.59,14.28 C21.2
  Top Layer w2.54: NOREF#3.1 1.57,4.43 1.57,7.95 v1(2.09,8.48)
  vias: v1(0.88,11.52) v1(0.88,10.91) v1(0.88,10.31) v1(0.88,9.69) v1(0.88,9.09) v1(0.88,8.48) v1(1.49,11.52) v1(1.49,10.91) v1(1.49,10.31) v1(1.49,9.69) v1(1.49,9.09) v1(1.49,8.48) v1(2.09,11.52) v1(2.09,10.91) v1(2.7,11.52) v1(2.7,10.91) v1(2.7,10.31) v1(2.7,9.69) v1(2.7,9.09) v1(2.7,8.48) v1(3.31,11.52) v1(3.31,10.91) v1(3.31,10.31) v1(3.31,9.69) v1(3.31,9.09) v1(3.31,8.48) v1(3.92,11.52) v1(3.92,10.91) v1(3.92,10.31) v1(3.92,9.69) v1(3.92,9.09) v1(3.92,8.48) v1(6.23,12.1) v1(6.23,11.49) v1(6.23,10.88) v1(6.23,10.27) v1(6.23,9.66) v1(6.84,12.1) v1(6.84,11.49) v1(6.84,10.88) v1(6.84,10.27) v1(6.84,9.66) v1(7.45,12.1) v1(7.45,11.49) v1(7.45,10.88) v1(7.45,10.27) v1(7.45,9.66) v1(8.06,12.1) v1(8.06,11.49) v1(8.06,10.88) v1(8.06,10.27) v1(8.06,9.66) v1(8.67,12.1) v1(8.67,11.49) v1(8.67,10.88) v1(8.67,10.27) v1(8.67,9.66) v1(9.28,12.1) v1(9.28,11.49) v1(9.28,10.88) v1(9.28,10.27) v1(9.28,9.66) v1(9.89,12.1) v1(9.89,11.49) v1(9.89,10.88) v1(9.89,10.27) v1(9.89,9.66) v1(10.5,12.1) v1(10.5,11.49) v1(10.5,10.88) v1(10.5,10.27) v1(10.5,9.66) v1(11.11,12.1) v1(11.11,11.49) v1(11.11,10.88) v1(11.11,10.27) v1(11.11,9.66) v1(24.74,12.27) v1(24.74,11.66) v1(24.74,11.05) v1(24.74,10.44) v1(24.74,9.83) v1(25.35,12.27) v1(25.35,11.66) v1(25.35,11.05) v1(25.35,10.44) v1(25.35,9.83) v1(25.96,12.27) v1(25.96,11.66) v1(25.96,11.05) v1(25.96,10.44) v1(25.96,9.83) v1(26.57,12.27) v1(26.57,11.66) v1(26.57,11.05) v1(26.57,10.44) v1(26.57,9.83) v1(27.18,12.27) v1(27.18,11.66) v1(27.18,11.05) v1(27.18,10.44) v1(27.18,9.83) v1(27.79,12.27) v1(27.79,11.66) v1(27.79,11.05) v1(27.79,10.44) v1(27.79,9.83) v1(28.4,12.27) v1(28.4,11.66) v1(28.4,11.05) v1(28.4,10.44) v1(28.4,9.83) v1(29.01,12.27) v1(29.01,11.66) v1(29.01,11.05) v1(29.01,10.44) v1(29.01,9.83) v1(29.67,12.27) v1(29.67,11.66) v1(29.67,11.05) v1(29.67,10.44) v1(29.67,9.83) v1(30.28,12.27) v1(30.28,11.66) v1(30.28,11.05) v1(30.28,10.44) v1(30.28,9.83) v1(30.88,12.27) v1(30.88,11.66) v1(30.88,11.05) v1(30.88,10.44) v1(30.88,9.83) v1(31.5,12.27) v1(31.5,11.66) v1(31.5,11.05) v1(31.5,10.44) v1(31.5,9.83) v1(32.1,12.27) v1(32.1,11.66) v1(32.1,11.05) v1(32.1,10.44) v1(32.1,9.83) v1(32.71,12.27) v1(32.71,11.66) v1(32.71,11.05) v1(32.71,10.44) v1(32.71,9.83) v1(33.32,12.27) v1(33.32,11.66) v1(33.32,11.05) v1(33.32,10.44) v1(33.32,9.83) v1(33.93,12.27) v1(33.93,11.66) v1(33.93,11.05) v1(33.93,10.44) v1(33.93,9.83) v1(48.62,12.27) v1(48.62,11.66) v1(48.62,11.05) v1(48.62,10.44) v1(48.62,9.83) v1(49.22,12.27) v1(49.22,11.66) v1(49.22,11.05) v1(49.22,10.44) v1(49.22,9.83) v1(49.84,12.27) v1(49.84,11.66) v1(49.84,11.05) v1(49.84,10.44) v1(49.84,9.83) v1(50.44,12.27) v1(50.44,11.66) v1(50.44,11.05) v1(50.44,10.44) v1(50.44,9.83) v1(51.05,12.27) v1(51.05,11.66) v1(51.05,11.05) v1(51.05,10.44) v1(51.05,9.83) v1(51.66,12.27) v1(51.66,11.66) v1(51.66,11.05) v1(51.66,10.44) v1(51.66,9.83) v1(52.27,12.27) v1(52.27,11.66) v1(52.27,11.05) v1(52.27,10.44) v1(52.27,9.83) v1(52.88,12.27) v1(52.88,11.66) v1(52.88,11.05) v1(52.88,10.44) v1(52.88,9.83)
EN1: length 34.9
  Top Layer w0.254: U32.11 51.32,30.72 49.28,32.77 34.93,32.77 32.74,30.58 32.74,24.67 R7.2 34.81,22.61 36.83,22.61 37.58,23.36 U7.14
EN1_IN: length 17.7
  Top Layer w0.254: U32.12 52.15,30.1 52.83,30.1 53.59,29.34 53.59,26.3 R33.1 54.24,24.13 55.37,24.13 58.93,20.57 58.93,19.81 60.53,18.21 U47.2
EN2: length 68.6
  Top Layer w0.254: U32.6 58.8,32.02 59.06,32.28 59.06,33.4 58.42,34.04 12.06,34.04 8.89,30.86 8.89,24.51 10.03,23.37 R15.2 11.18,22.61 13.34,22.61 14.16,23.43 U12.14
EN2_IN: length 15.4
  Top Layer w0.254: 58.42,31.37 57.02,31.37 56.13,30.48 56.13,28.7 56.64,28.19 56.64,26.3 R35.1 60.71,20.7 61.13,20.7 U47.4
MOTOR1N: length 17.7
  Top Layer w0.254: U11.5 35.81,9.66 35.81,18.92 38.25,21.36 U7.18
  vias: v1(30.66,5.33) v1(30.66,4.72) v1(31.27,5.33) v1(31.27,4.72) v1(31.88,5.33) v1(31.88,4.72) v1(32.49,5.33) v1(32.49,4.72) v1(33.1,5.33) v1(33.1,4.72) v1(37.26,5.34) v1(37.26,4.73) v1(37.87,5.34) v1(37.87,4.73) v1(38.48,5.34) v1(38.48,4.73) v1(39.09,5.34) v1(39.09,4.73) v1(39.7,5.34) v1(39.7,4.73)
MOTOR1P: length 17.4
  Top Layer w0.254: U9.5 44.83,6.99 47.37,9.53 47.37,14.86 42.15,20.08 U7.23
  vias: v1(43.1,5.3) v1(43.1,4.69) v1(43.71,5.3) v1(43.71,4.69) v1(44.32,5.3) v1(44.32,4.69) v1(44.93,5.3) v1(44.93,4.69) v1(45.54,5.3) v1(45.54,4.69) v1(48.56,5.33) v1(48.56,4.72) v1(49.17,5.33) v1(49.17,4.72) v1(49.78,5.33) v1(49.78,4.72) v1(50.39,5.33) v1(50.39,4.72) v1(51,5.33) v1(51,4.72)
MOTOR2N: length 17.7
  Top Layer w0.254: U16.5 12.32,9.53 12.32,19.05 14.7,21.43 U12.18
  vias: v1(6.91,5.21) v1(6.91,4.6) v1(7.52,5.21) v1(7.52,4.6) v1(8.13,5.21) v1(8.13,4.6) v1(8.74,5.21) v1(8.74,4.6) v1(9.35,5.21) v1(9.35,4.6) v1(13.64,5.35) v1(13.64,4.74) v1(14.25,5.35) v1(14.25,4.74) v1(14.86,5.35) v1(14.86,4.74) v1(15.47,5.35) v1(15.47,4.74) v1(16.08,5.35) v1(16.08,4.74)
MOTOR2P: length 17.7
  Top Layer w0.254: U12.23 18.66,20.2 23.62,15.24 23.62,8.76 21.85,6.99 U14.5
  vias: v1(19.48,5.36) v1(19.48,4.75) v1(20.09,5.36) v1(20.09,4.75) v1(20.7,5.36) v1(20.7,4.75) v1(21.31,5.36) v1(21.31,4.75) v1(21.92,5.36) v1(21.92,4.75) v1(24.94,5.33) v1(24.94,4.72) v1(25.55,5.33) v1(25.55,4.72) v1(26.16,5.33) v1(26.16,4.72) v1(26.77,5.33) v1(26.77,4.72) v1(27.38,5.33) v1(27.38,4.72)
NSLEEP: length 60.9
  Top Layer w0.254: v1(5.51,23.7) 5.44,23.63 SW1.2 ; v1(33.27,29.46) 33.27,25.66 R55.2 34.81,24.13 36.07,24.13 36.34,23.86 U7.13 ; U12.13 12.9,23.93 12.7,24.13 11.18,24.13 R56.2 9.53,25.78 v1(9.53,25.78)
  Bottom Layer w0.254: v1(33.27,29.46) 29.72,33.02 16.51,33.02 14.99,31.5 7.24,31.5 5.51,29.77 v1(5.51,23.7) 7.45,23.7 v1(9.53,25.78)
PH1: length 37.5
  Top Layer w0.254: U32.8 51.4,33.4 34.8,33.4 32.13,30.73 32.13,23.76 R8.2 34.81,21.08 36.32,21.08 38.1,22.86 U7.15
PH1_IN: length 18.4
  Top Layer w0.254: U32.9 52.14,32 53.34,32 55.12,30.23 55.12,26.3 R34.1 54.36,25.53 55.25,24.64 55.75,24.64 59.56,20.83 59.56,20.19 60.29,19.46 U47.3
PH2: length 75.4
  Top Layer w0.254: U12.15 14.42,22.93 12.62,21.13 11.13,21.13 R16.2 8.25,24.01 8.25,31.11 11.71,34.57 59.31,34.57 59.94,33.94 59.94,30.99 59.03,30.07 U32.3
PH2_IN: length 10.9
  Top Layer w0.254: U32.2 58.59,29.42 59.06,28.96 59.06,27.19 R36.1 57.4,25.02 60.45,21.97 61.13,21.97 U47.5
SO1: length 38.9
  Top Layer w0.254: v1(62.48,24.51) 62.43,24.46 U47.7 ; R41.1 34.04,30.42 v1(35.85,32.23)
  Bottom Layer w0.254: v1(62.48,24.51) 62.48,27.31 56.26,33.53 37.15,33.53 v1(35.85,32.23)
SO2: length 65.6
  Top Layer w0.254: R42.1 10.42,30.36 12.93,32.87 v1(14.35,32.87) ; U47.6 63.09,23.21 v1(63.12,23.24)
  Bottom Layer w0.254: v1(14.35,32.87) 15.77,34.29 56.39,34.29 63.12,27.56 v1(63.12,23.24)
$1N2211: length 12.4
  Top Layer w0.254: LED1.2 39.46,31.75 41.18,31.75 LED2.2 43.46,31.03 C11.2 42.8,30.16 42.8,28.96 42.15,28.31 U7.8
$1N2213: length 6.8
  Top Layer w0.254: U7.11 40.65,25.13 40.26,25.53 37.96,25.53 R41.2
$1N2223: length 26.5
  Top Layer w0.254: C10.2 45.34,29.68 44.45,30.57 44.45,31.5 43.81,32.13 36.7,32.13 34.8,30.23 34.8,27.17 R5.2 ; C10.2 45.34,28.96 44.58,28.19 43.69,28.19 42.65,27.16 U7.7 ; C10.2 46.42,28.45 R51.1
$1N2224: length 5.4
  Top Layer w0.254: U7.12 37.41,24.55 R5.1
$1N2225: length 5.5
  Top Layer w0.254: R4.1 41.65,28.08 U7.9
$1N2226: length 7.9
  Top Layer w0.254: U7.10 41.15,27.56 40.26,28.45 38.11,28.45 R3.1
$1N2227: length 2.3
  Top Layer w0.254: R4.2 41.81,29.43 LED2.1
$1N2228: length 2.3
  Top Layer w0.254: R3.2 38.64,29.43 LED1.1
$1N2229: length 7.7
  Top Layer w0.254: R51.2 49.14,28.43 R52.1 44.57,23.86 U7.6
$1N2235: length 5.1
  Top Layer w0.254: U7.2 45.22,21.86 47.12,23.75 C8.1
$1N2236: length 5.4
  Top Layer w0.254: C6.1 46.99,25.4 44.45,22.86 U7.4
$1N2237: length 7
  Top Layer w0.254: C6.2 48.2,24.51 46.99,24.51 44.84,22.36 U7.3
$1N2244: length 20
  Top Layer w0.254: U10.4 35.18,5.59 35.18,19.05 37.99,21.86 U7.17
$1N2245: length 12.7
  Top Layer w0.254: U7.19 38.4,20.66 36.45,18.7 36.45,10.67 U11.4
$1N2246: length 9.8
  Top Layer w0.203: U7.21 41.06,20.56 41.06,19.95 42.85,18.16 42.85,15.16 42.29,14.61 41.15,14.61 40.89,14.35 U21.2
$1N2248: length 18.6
  Top Layer w0.254: U9.4 42.42,9.65 42.67,9.4 46.35,9.4 46.86,9.91 46.86,14.73 41.65,19.94 U7.22
$1N2249: length 21.5
  Top Layer w0.254: U7.24 42.65,20.21 47.88,14.99 47.88,6.35 48.26,5.97 51.18,5.97 U8.4
$1N2250: length 21.6
  Top Layer w0.254: U12.24 19.16,20.59 24.13,15.62 24.13,6.48 24.7,5.91 27.63,5.91 U13.4
$1N2251: length 17.9
  Top Layer w0.254: U14.4 18.8,10.41 19.81,9.4 22.56,9.4 23.13,9.97 23.13,14.97 18.16,19.94 U12.22
$1N2253: length 11.2
  Top Layer w0.203: U18.2 17.15,13.97 17.47,14.3 19.38,14.3 19.94,14.86 19.94,17.4 17.56,19.78 17.56,20.63 U12.21
$1N2254: length 12.8
  Top Layer w0.254: U16.4 12.95,18.8 14.89,20.73 U12.19
$1N2255: length 20.5
  Top Layer w0.254: U12.17 14.31,21.93 11.68,19.3 11.68,5.84 10.73,4.89 10.73,4.64 10.78,4.59
$1N2262: length 6.7
  Top Layer w0.254: U12.3 21.16,22.43 23.24,24.51 24.45,24.51 C12.2
$1N2263: length 5.1
  Top Layer w0.254: C12.1 23.24,25.4 20.77,22.93 U12.4
$1N2264: length 4.8
  Top Layer w0.254: C14.1 23.37,23.75 21.55,21.93 U12.2
$1N2270: length 7.4
  Top Layer w0.254: R53.2 25.39,28.43 R54.1 20.89,23.93 U12.6
$1N2271: length 12.8
  Top Layer w0.254: LED3.2 15.97,32 17.81,32 LED4.2 18.64,31.18 C17.2 19.43,30.42 19.43,29.08 18.66,28.31 U12.8
$1N2272: length 2.3
  Top Layer w0.254: R11.2 15.19,29.63 15.2,29.63
$1N2273: length 2.3
  Top Layer w0.254: R12.2 16.99,31.23 LED4.1
$1N2274: length 8.3
  Top Layer w0.254: U12.10 17.66,28.2 17.03,28.83 14.49,28.83 R11.1
$1N2275: length 5.6
  Top Layer w0.254: R12.1 18.16,28.46 U12.9
$1N2277: length 7.4
  Top Layer w0.254: R42.2 12.95,27.17 12.95,26.42 13.97,25.4 16.78,25.4 17.16,25.02 U12.11
$1N2278: length 5.5
  Top Layer w0.254: U12.12 13.85,24.63 R13.1
$1N2279: length 30
  Top Layer w0.254: R13.2 9.53,27.44 9.53,30.48 12.45,33.4 19.81,33.4 21.21,32 21.21,30.54 C16.2 ; C16.2 22.55,29.78 R53.1 ; C16.2 21.97,29.08 21.08,28.19 19.56,28.19 19.16,27.79 U12.7
$1N16007: length 1.8
  Top Layer w0.254: C28.1 59.81,7.3 U46.6
$1N18591: length 2.2
  Top Layer w0.254: LED5.1 57.5,19.43 R58.2

## Copper pours and planes (outline as drawn; the poured copper is in the pictures)
3V3 on Top Layer: 57.98,17.22 58.28,17.53 59.31,17.53 59.69,17.14 59.69,10.03 59.94,9.78 60.94,9.78 61.2,10.04 61.2,11.67 61.47,11.94 64.52,11.94 64.77,11.68 64.77,10.03 64.52,9.78 62.61,9.78 61.47,8.64 57.46,8.64 57.15,8.95 57.15,12.28 57.98,13.1
GND on Top Layer: 48.39,31.4 50.52,33.53 58.55,33.53 59.44,32.64 59.44,30.61 61.09,28.96 66.68,28.96 67.44,28.19 67.44,-0.51 66.17,-1.78 55.5,-1.78 53.47,0.25 53.47,21.46 50.42,24.51 50.42,28.96 50.04,29.34 48.96,29.34 48.39,29.91
GND on Bottom Layer: 50.29,32.39 51.56,33.66 59.06,33.66 60.07,32.64 60.07,30.61 61.47,29.2 66.3,29.2 67.18,28.32 67.18,-0.25 66.29,-1.14 54.23,-1.14 53.47,-0.38 53.47,21.46 50.29,24.64
PGND on Top Layer: 13.21,18.54 14.6,19.94 16.64,19.94 19.3,17.27 19.3,15.24 19.18,15.11 13.46,15.11 13.21,15.37
PGND on Top Layer: 36.83,18.67 38.23,20.07 40.13,20.07 42.29,17.91 42.29,15.75 41.91,15.37 37.21,15.37 36.83,15.75
PGND on Top Layer: -0.25,37.21 66.29,37.21 70.49,33.02 70.49,0.25 66.42,-3.81 -0.38,-3.81 -4.7,0.51 -4.7,32.77
PGND on Bottom Layer: -6.86,31.5 -1.91,36.45 65.53,36.45 70.49,31.5 70.49,1.52 65.53,-3.43 -2.16,-3.43 -6.86,1.27
DC_IN on Top Layer: 48.47,13.97 52.75,13.97 52.97,13.75 52.97,6.48 52.71,6.22 48.39,6.22 48.13,6.48 48.13,13.63
DC_IN on Top Layer: 24.38,13.33 24.8,13.75 34.34,13.75 34.75,13.34 34.75,6.43 34.29,5.97 25.02,5.97 24.38,6.6
DC_IN on Top Layer: 6.15,13.72 11.1,13.72 11.39,13.42 11.39,6.44 11.05,6.1 6.22,6.1 5.84,6.48 5.84,13.41
DC_IN on Top Layer: 51.56,6.98 52.07,7.49 52.96,7.49 53.34,7.11 53.34,6.6 53.59,6.35 55.24,6.35 55.68,6.79 56.99,6.79 57.21,6.57 57.21,5.01 56.9,4.7 53.85,4.7
DC_IN on Bottom Layer: 0,12.01 0.43,12.45 4.48,12.45 6.39,14.35 52.71,14.35 53.34,13.72 53.34,7.71 51.6,5.97 0.47,5.97 0,6.44
MOTOR1N on Top Layer: 30.18,5.46 33.4,5.46 33.78,5.08 33.78,4.32 34.04,4.06 35.56,4.06 35.81,4.32 35.81,8.64 36.19,9.02 40.78,9.02 41.14,8.66 41.14,0.88 40.51,0.25 30.35,0.25 29.84,0.76 29.84,5.13
MOTOR1N on Bottom Layer: 29.59,5.07 30.35,5.83 40.51,5.83 41.4,4.94 41.4,1.01 40.64,0.24 30.35,0.24 29.59,1.01
MOTOR1P on Top Layer: 42.02,9.02 46.61,9.02 46.98,8.65 46.98,6.1 47.5,5.59 51.18,5.59 51.69,5.08 51.69,0.89 51.05,0.25 42.29,0.25 41.66,0.89 41.66,8.66
MOTOR1P on Bottom Layer: 40.89,5.06 41.65,5.83 51.81,5.83 52.7,4.94 52.7,1 51.94,0.24 41.65,0.24 40.89,1
MOTOR2N on Top Layer: 6.62,5.46 9.65,5.46 10.16,4.95 10.16,4.19 10.41,3.94 11.94,3.94 12.19,4.19 12.19,8.76 12.45,9.02 17.25,9.02 17.52,8.74 17.52,0.75 17.02,0.25 6.6,0.25 6.1,0.76 6.1,4.94
MOTOR2N on Bottom Layer: 5.97,5.08 6.73,5.84 16.89,5.84 17.78,4.95 17.78,1.02 17.02,0.25 6.73,0.25 5.97,1.02
MOTOR2P on Top Layer: 18.31,9.02 23.08,9.02 23.36,8.74 23.36,5.98 23.75,5.59 27.56,5.59 28.07,5.08 28.07,0.76 27.56,0.25 18.54,0.25 18.03,0.76 18.03,8.74
MOTOR2P on Bottom Layer: 17.27,5.06 18.03,5.83 28.19,5.83 29.08,4.94 29.08,1 28.32,0.24 18.03,0.24 17.27,1
$1N2246 on Top Layer: 37.08,13.21 37.69,13.82 45.75,13.82 46.61,12.95 46.61,9.91 46.35,9.65 37.72,9.65 37.08,10.29
$1N2253 on Top Layer: 13.72,13.21 14.1,13.59 22.22,13.59 22.94,12.87 22.94,10.16 22.56,9.78 14.1,9.78 13.72,10.16
$1N16004 on Top Layer: 58.27,6.86 59.46,6.86 59.71,7.11 61.21,7.11 61.98,7.87 64.52,7.87 64.77,7.62 64.77,6.1 64.52,5.84 58.29,5.84 57.91,6.22 57.91,6.5

Small or netless copper shapes (teardrops, artwork), in the pictures only: 206 on Top Layer, 10 on Bottom Layer

## Text on the board
Bottom Layer: 2025.3.7 天津大学 发光MOS管队
Bottom Silkscreen Layer: Ver 2.0 Designed by | simplemaxq
Top Silkscreen Layer: 3V3 | ON / OFF | GND / SO1 / SO2 / PH2 / EN2 / PH1 / EN1 / GND | SNSOUT nFAULT
